# Altium schematic sheet 1_AT32_FOC_CORE.schdoc.schdoc
size 850 x 607 mm; Symbol: Sheet-Symbol_A3; Device: Sheet-Symbol_A3; Company: 嘉立创EDA; Version: V1.0; Page Size: A3; @Project Name: 基于AT32F413 的FOC驱动器; @Page Count: 1; @Update Date: 2024-04-27; @Create Date: 2023-11-18; @Schematic Name: AT32_FOC; @Page No: 1; @Page Name: AT32_FOC_CORE
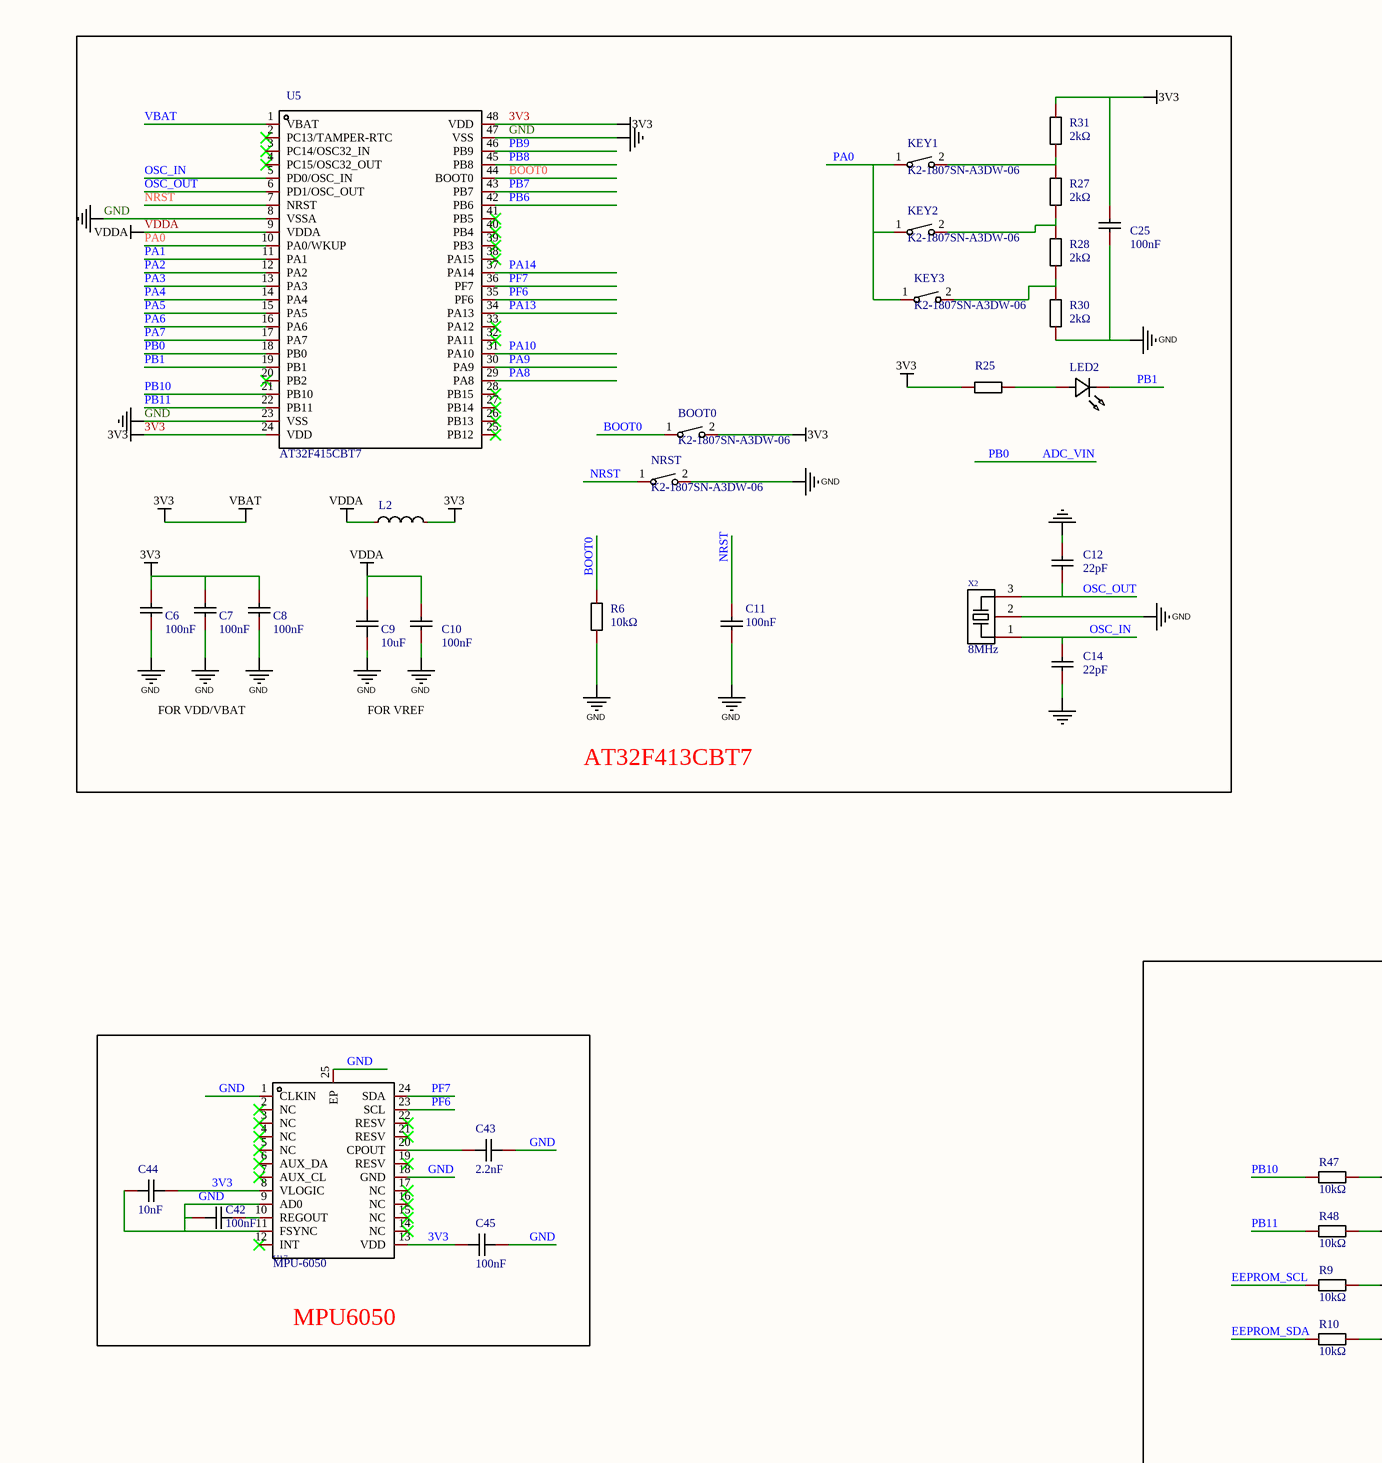
[diagram p0: 1_AT32_FOC_CORE.schdoc.schdoc, top left]
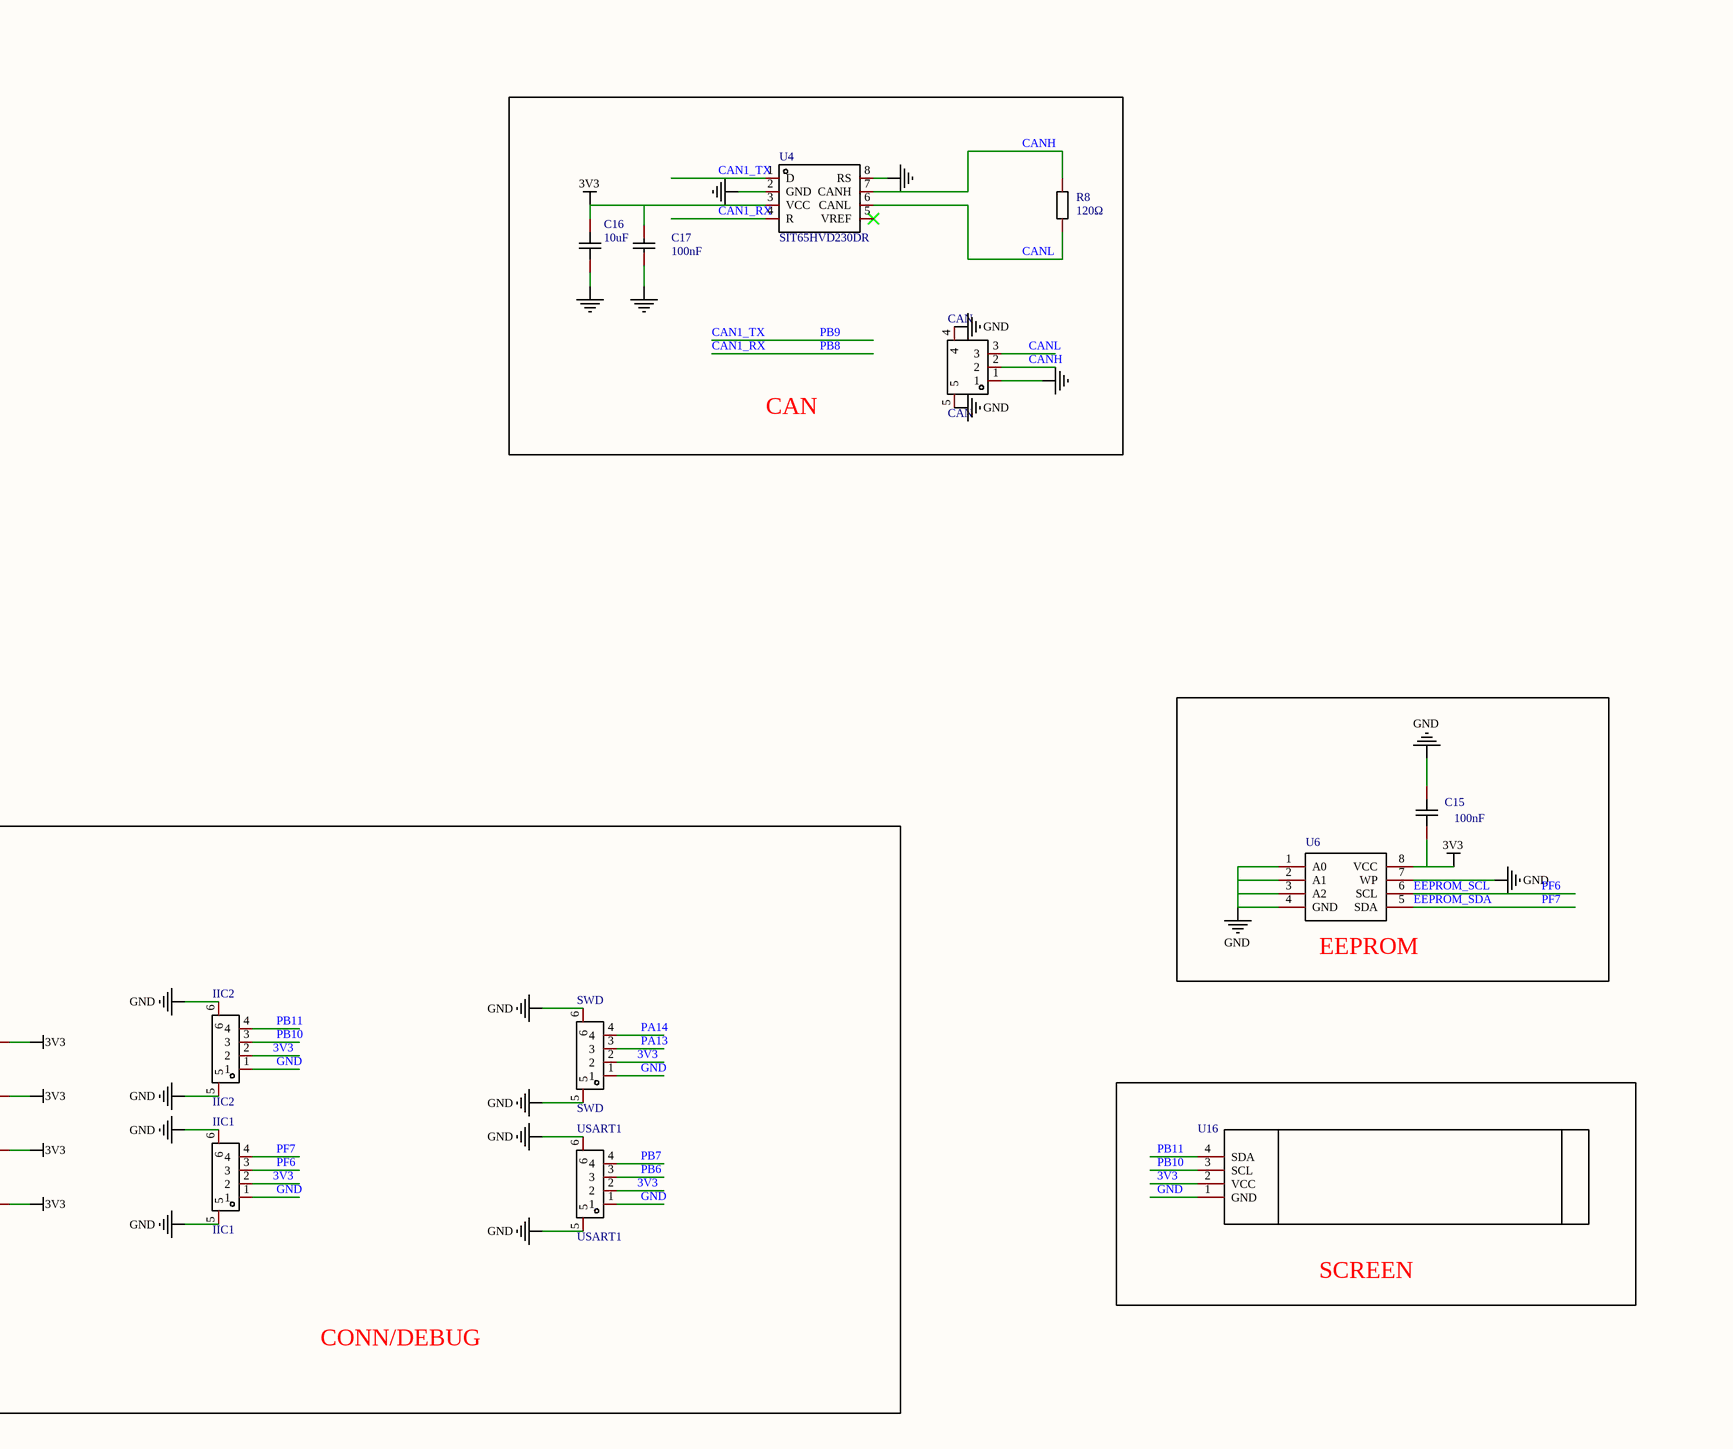
[diagram p1: 1_AT32_FOC_CORE.schdoc.schdoc, top middle]
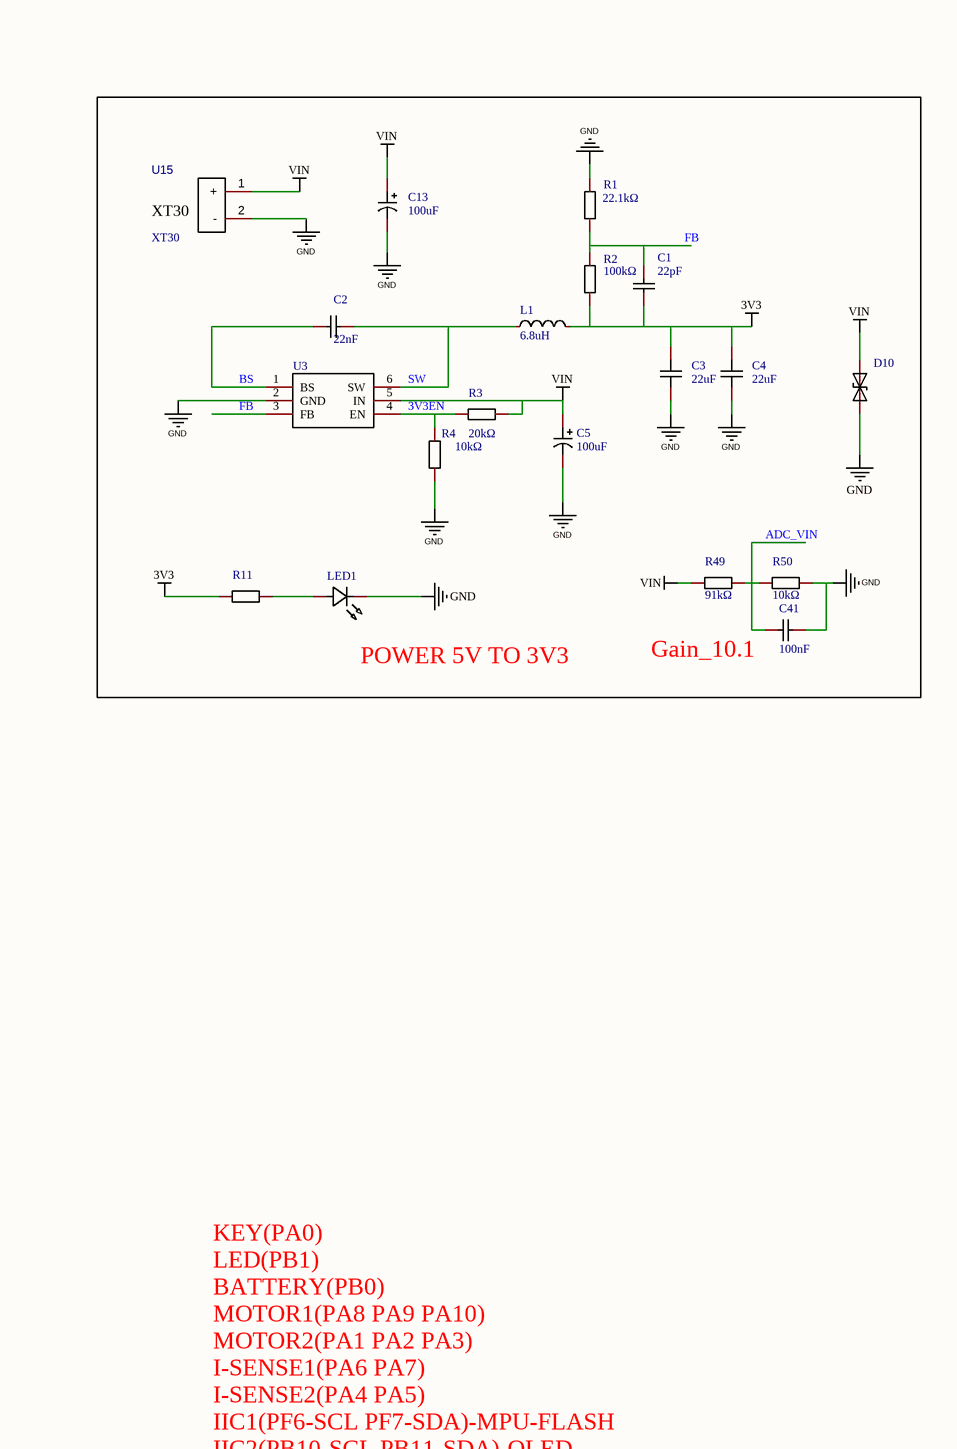
[diagram p2: 1_AT32_FOC_CORE.schdoc.schdoc, top right]
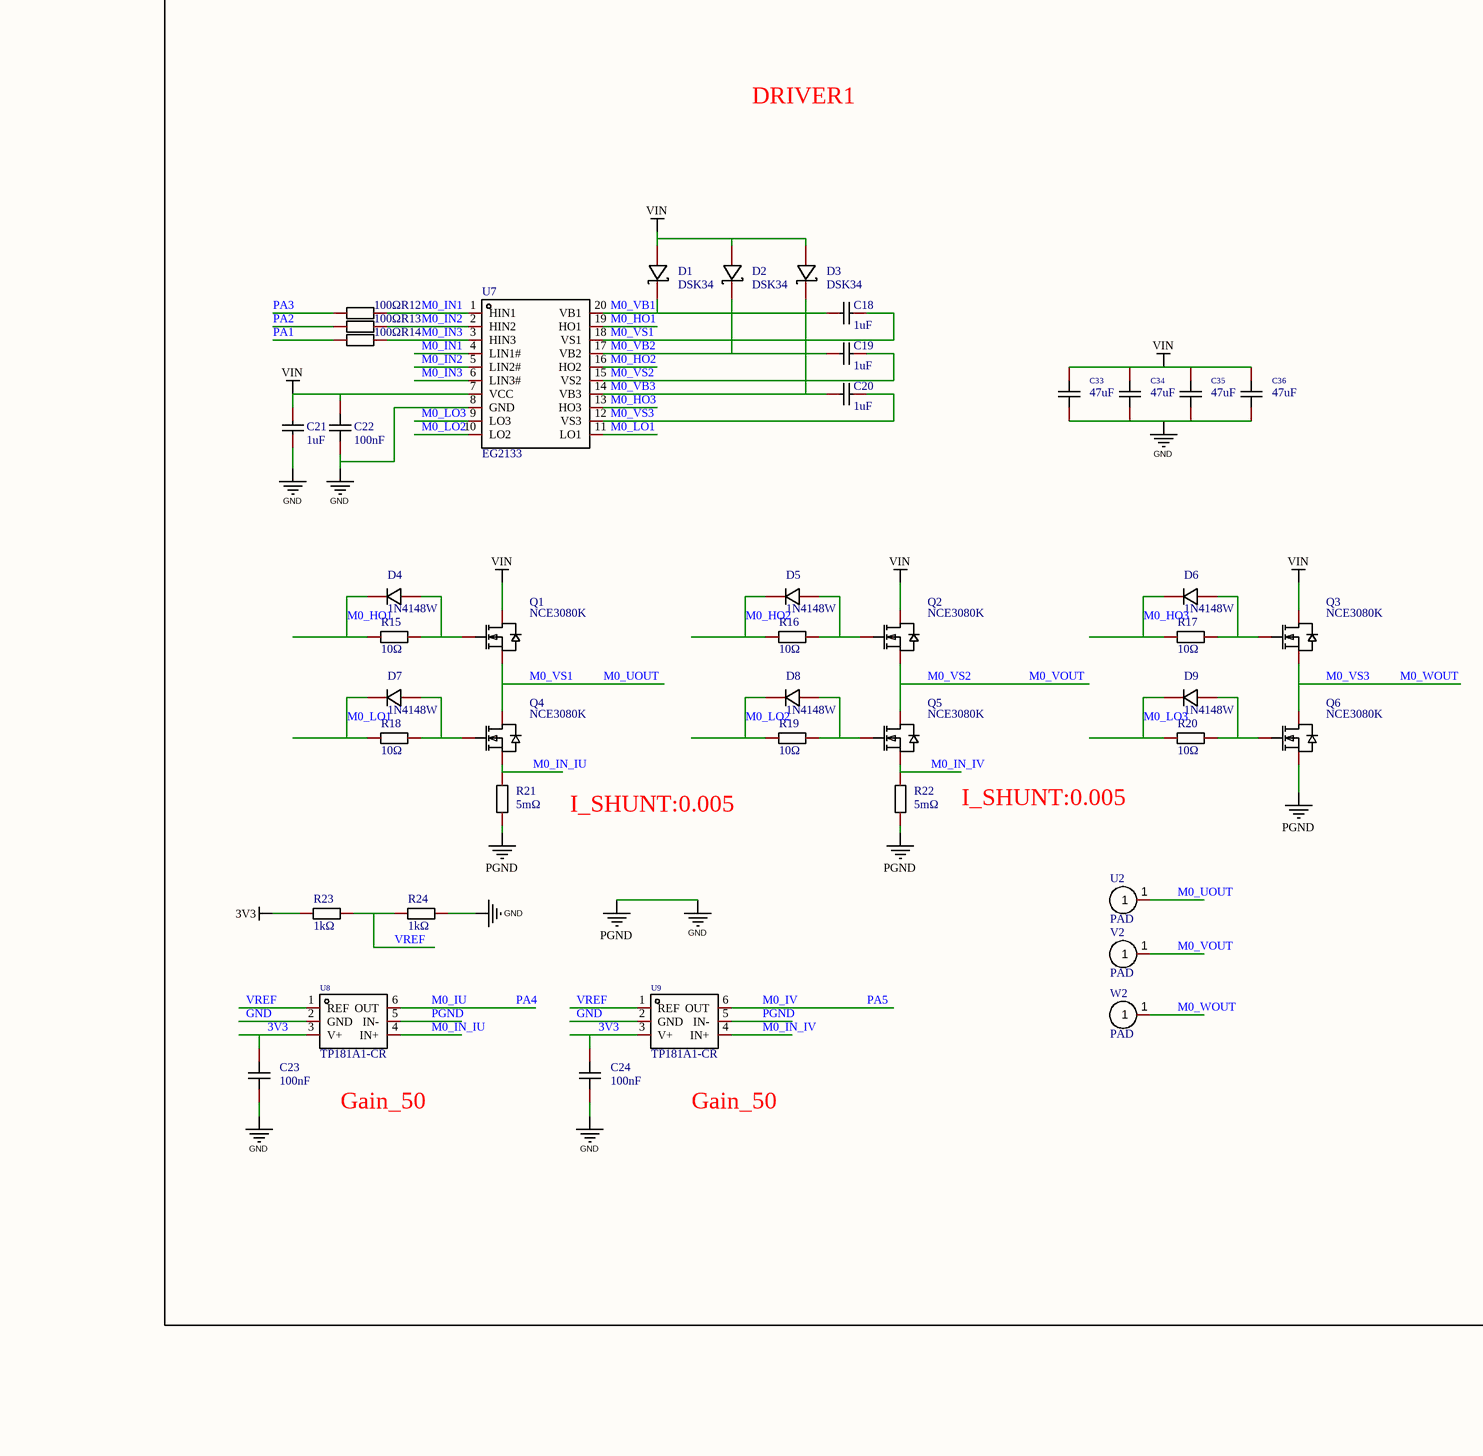
[diagram p3: 1_AT32_FOC_CORE.schdoc.schdoc, bottom left]
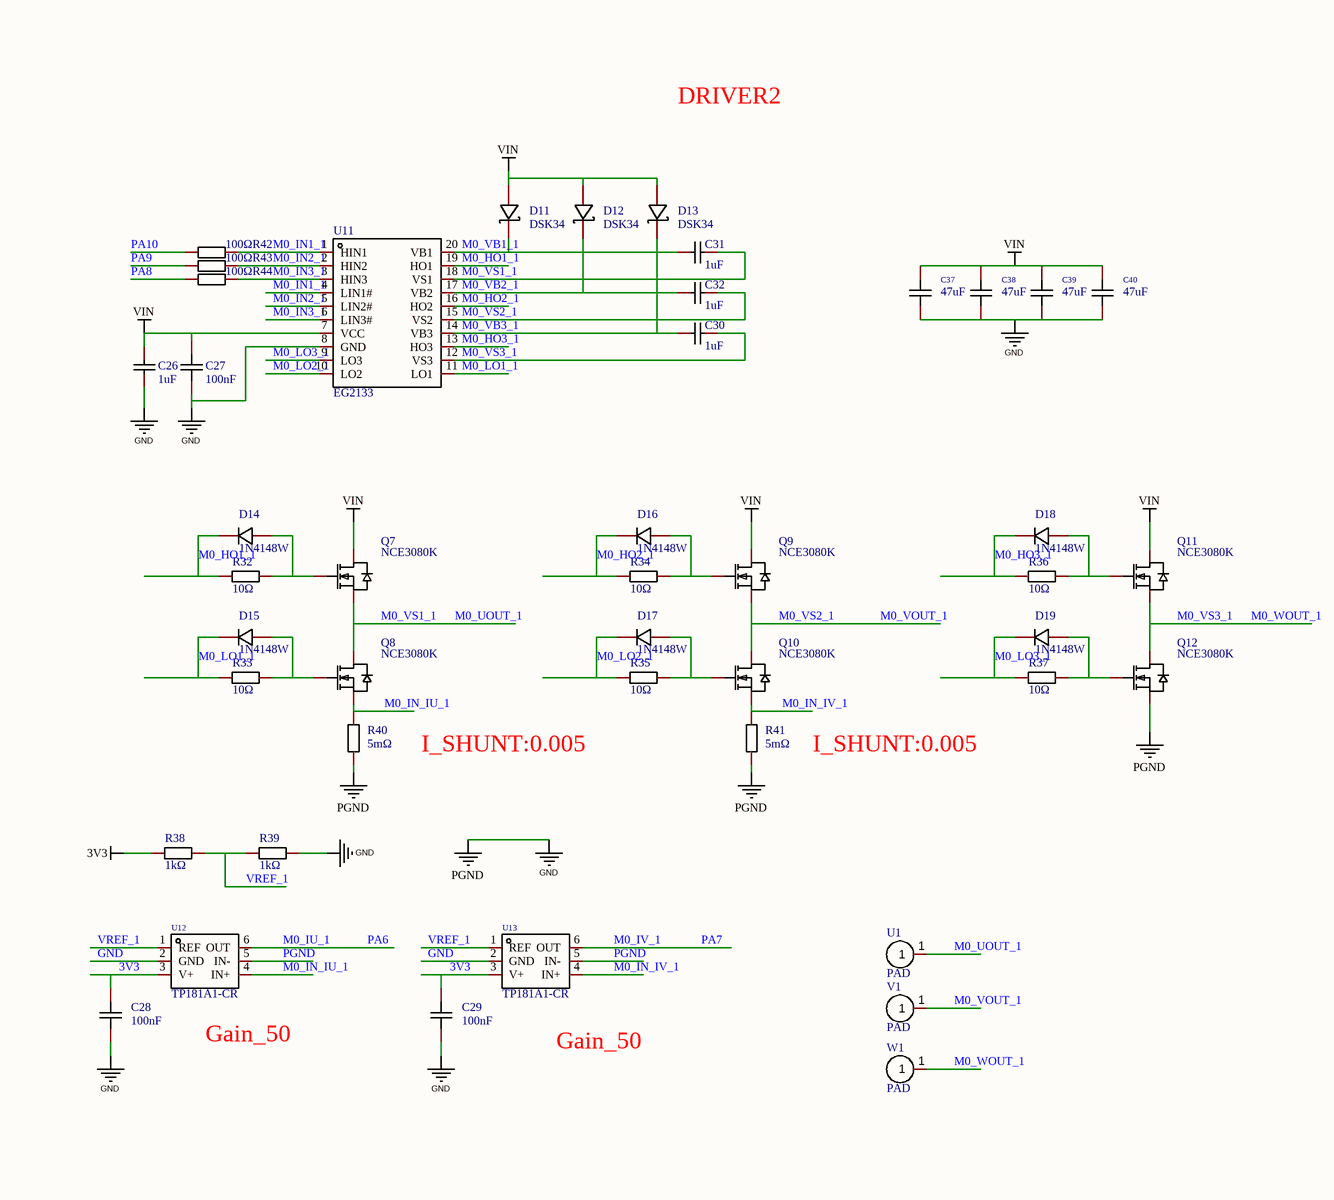
[diagram p4: 1_AT32_FOC_CORE.schdoc.schdoc, bottom middle]

## Parts
BOOT0  K2-1807SN-A3DW-06  [SW-SMD_L4.0-W2.9-LS5.0]
C1  22pF  [C0402]
C2  22nF  [C0402]
C3  22uF  [C1206]
C4  22uF  [C1206]
C5  100uF  [CAP-SMD_BD6.3-L6.6-W6.6-LS7.2-FD]
C6  100nF  [C0402]
C7  100nF  [C0402]
C8  100nF  [C0402]
C9  10uF  [C1206]
C10  100nF  [C0402]
C11  100nF  [C0402]
C12  22pF  [C0402]
C13  100uF  [CAP-SMD_BD6.3-L6.6-W6.6-LS7.2-FD]
C14  22pF  [C0402]
C15  100nF  [C0402]
C16  10uF  [C0402]
C17  100nF  [C0402]
C18  1uF  [C0402]
C19  1uF  [C0402]
C20  1uF  [C0402]
C21  1uF  [C0402]
C22  100nF  [C0402]
C23  100nF  [C0402]
C24  100nF  [C0402]
C25  100nF  [C0402]
C26  1uF  [C0402]
C27  100nF  [C0402]
C28  100nF  [C0402]
C29  100nF  [C0402]
C30  1uF  [C0402]
C31  1uF  [C0402]
C32  1uF  [C0402]
C33  47uF  [C1206]
C34  47uF  [C1206]
C35  47uF  [C1206]
C36  47uF  [C1206]
C37  47uF  [C1206]
C38  47uF  [C1206]
C39  47uF  [C1206]
C40  47uF  [C1206]
C41  100nF  [C0402]
C42  100nF  [C0402]
C43  2.2nF  [C0402]
C44  10nF  [C0402]
C45  100nF  [C0402]
CAN  CAN  [CONN-SMD_AFC10-S03QCA-00]
D1  DSK34  [SOD-123_L2.8-W1.8-LS3.7-RD]
D2  DSK34  [SOD-123_L2.8-W1.8-LS3.7-RD]
D3  DSK34  [SOD-123_L2.8-W1.8-LS3.7-RD]
D4  1N4148W  [SOD-123F_L2.7-W1.6-LS3.8-RD]
D5  1N4148W  [SOD-123F_L2.7-W1.6-LS3.8-RD]
D6  1N4148W  [SOD-123F_L2.7-W1.6-LS3.8-RD]
D7  1N4148W  [SOD-123F_L2.7-W1.6-LS3.8-RD]
D8  1N4148W  [SOD-123F_L2.7-W1.6-LS3.8-RD]
D9  1N4148W  [SOD-123F_L2.7-W1.6-LS3.8-RD]
D10  SMAJ12CA/TR13  [SMA_L4.4-W2.6-LS5.0-BI]  (value not drawn)
D11  DSK34  [SOD-123_L2.8-W1.8-LS3.7-RD]
D12  DSK34  [SOD-123_L2.8-W1.8-LS3.7-RD]
D13  DSK34  [SOD-123_L2.8-W1.8-LS3.7-RD]
D14  1N4148W  [SOD-123F_L2.7-W1.6-LS3.8-RD]
D15  1N4148W  [SOD-123F_L2.7-W1.6-LS3.8-RD]
D16  1N4148W  [SOD-123F_L2.7-W1.6-LS3.8-RD]
D17  1N4148W  [SOD-123F_L2.7-W1.6-LS3.8-RD]
D18  1N4148W  [SOD-123F_L2.7-W1.6-LS3.8-RD]
D19  1N4148W  [SOD-123F_L2.7-W1.6-LS3.8-RD]
IIC1  IIC1  [CONN-SMD_AFC10-S04QCA-00]
IIC2  IIC2  [CONN-SMD_AFC10-S04QCA-00]
KEY1  K2-1807SN-A3DW-06  [SW-SMD_L4.0-W2.9-LS5.0]
KEY2  K2-1807SN-A3DW-06  [SW-SMD_L4.0-W2.9-LS5.0]
KEY3  K2-1807SN-A3DW-06  [SW-SMD_L4.0-W2.9-LS5.0]
L1  value 6.8uH  [IND-SMD_L7.1-W6.6]  (hidden comment: 0630 6.8uH)
L2  CMH160808B3R3MT  [L0603]  (value not drawn)
LED1  XL-1608UBC-04  [LED0603-RD_BLUE]  (value not drawn)
LED2  XL-1608UBC-04  [LED0603-RD_BLUE]  (value not drawn)
NRST  K2-1807SN-A3DW-06  [SW-SMD_L4.0-W2.9-LS5.0]
Q1  NCE3080K  [TO-252-2_L6.6-W6.1-P4.57-LS9.9-TL-CW]
Q2  NCE3080K  [TO-252-2_L6.6-W6.1-P4.57-LS9.9-TL-CW]
Q3  NCE3080K  [TO-252-2_L6.6-W6.1-P4.57-LS9.9-TL-CW]
Q4  NCE3080K  [TO-252-2_L6.6-W6.1-P4.57-LS9.9-TL-CW]
Q5  NCE3080K  [TO-252-2_L6.6-W6.1-P4.57-LS9.9-TL-CW]
Q6  NCE3080K  [TO-252-2_L6.6-W6.1-P4.57-LS9.9-TL-CW]
Q7  NCE3080K  [TO-252-2_L6.6-W6.1-P4.57-LS9.9-TL-CW]
Q8  NCE3080K  [TO-252-2_L6.6-W6.1-P4.57-LS9.9-TL-CW]
Q9  NCE3080K  [TO-252-2_L6.6-W6.1-P4.57-LS9.9-TL-CW]
Q10  NCE3080K  [TO-252-2_L6.6-W6.1-P4.57-LS9.9-TL-CW]
Q11  NCE3080K  [TO-252-2_L6.6-W6.1-P4.57-LS9.9-TL-CW]
Q12  NCE3080K  [TO-252-2_L6.6-W6.1-P4.57-LS9.9-TL-CW]
R1  22.1kΩ  [R0402]
R2  100kΩ  [R0402]
R3  20kΩ  [R0402]
R4  10kΩ  [R0402]
R6  10kΩ  [R0402]
R8  120Ω  [R0402]
R9  10kΩ  [R0402]
R10  10kΩ  [R0402]
R11  5.1kΩ  [R0402]  (value not drawn)
R12  100Ω  [R0402]
R13  100Ω  [R0402]
R14  100Ω  [R0402]
R15  10Ω  [R0805_NEW]
R16  10Ω  [R0805_NEW]
R17  10Ω  [R0805_NEW]
R18  10Ω  [R0805_NEW]
R19  10Ω  [R0805_NEW]
R20  10Ω  [R0805_NEW]
R21  5mΩ  [RES-SMD_L6.4-W3.2-1]
R22  5mΩ  [RES-SMD_L6.4-W3.2-1]
R23  1kΩ  [R0402]
R24  1kΩ  [R0402]
R25  5.1kΩ  [R0402]  (value not drawn)
R27  2kΩ  [R0402]
R28  2kΩ  [R0402]
R30  2kΩ  [R0402]
R31  2kΩ  [R0402]
R32  10Ω  [R0805_NEW]
R33  10Ω  [R0805_NEW]
R34  10Ω  [R0805_NEW]
R35  10Ω  [R0805_NEW]
R36  10Ω  [R0805_NEW]
R37  10Ω  [R0805_NEW]
R38  1kΩ  [R0402]
R39  1kΩ  [R0402]
R40  5mΩ  [RES-SMD_L6.4-W3.2-1]
R41  5mΩ  [RES-SMD_L6.4-W3.2-1]
R42  100Ω  [R0402]
R43  100Ω  [R0402]
R44  100Ω  [R0402]
R47  10kΩ  [R0402]
R48  10kΩ  [R0402]
R49  91kΩ  [R0402]
R50  10kΩ  [R0402]
SWD  SWD  [CONN-SMD_AFC10-S04QCA-00]
U1  PAD  [PAD-1.5]
U2  PAD  [PAD-1.5]
U3  MT2492  [SOT-23-6_L2.9-W1.6-P0.95-LS2.8-BL]  (value not drawn)
U4  SIT65HVD230DR  [SOP-8_L4.9-W3.9-P1.27-LS6.0-BL]
U5  AT32F415CBT7  [LQFP-48_L7.0-W7.0-P0.50-LS9.0-BL]
U6  AT24C02C-SSHM-T  [SOIC-8_L5.0-W4.0-P1.27-LS6.0-BL]  (value not drawn)
U7  EG2133  [TSSOP-20_L6.5-W4.4-P0.65-LS6.4-BL]
U8  TP181A1-CR  [SC70-6_L2.1-W1.3-P0.65-LS2.3-BL]
U9  TP181A1-CR  [SC70-6_L2.1-W1.3-P0.65-LS2.3-BL]
U11  EG2133  [TSSOP-20_L6.5-W4.4-P0.65-LS6.4-BL]
U12  TP181A1-CR  [SC70-6_L2.1-W1.3-P0.65-LS2.3-BL]
U13  TP181A1-CR  [SC70-6_L2.1-W1.3-P0.65-LS2.3-BL]
U15  XT30  [XT-30]
U16  0.91OLED-4P-IIC模块  [OLED-0.91-2.54*4P-IIC]  (value not drawn)
U17  MPU-6050  [QFN-24_L4.0-W4.0-P0.50-BL-EP2.7]
USART1  USART1  [CONN-SMD_AFC10-S04QCA-00]
V1  PAD  [PAD-1.5]
V2  PAD  [PAD-1.5]
W1  PAD  [PAD-1.5]
W2  PAD  [PAD-1.5]
X2  8MHz  [OSC-SMD_3P-L3.2-W1.3-P1.2-L]

## Blocks framed on the sheet
AT32F413CBT7: BOOT0 C6-C12 C14 C25 KEY1-KEY3 L2 LED2 NRST R6 R25 R27 R28 R30 R31 U5 X2
CAN: C16 C17 CAN R8 U4
EEPROM: C15 U6
CONN/DEBUG: IIC1 IIC2 R9 R10 R47 R48 SWD USART1
MPU6050: C42-C45 U17
SCREEN: U16

## Nets
3V3: BOOT0.2 C1.1 C3.2 C4.2 C6.2 C7.2 C8.2 C15.1 C16.2 C17.2 C23.1 C24.1 C25.2 C28.1 C29.1 C44.1 C45.2 IIC1.2 IIC2.2 L1.2 L2.2 R2.1 R9.2 R10.2 R11.1 R23.1 R25.1 R31.2 R38.1 R47.2 R48.2 SWD.2 U4.3(VCC) U5.1(VBAT) U5.24(VDD) U5.48(VDD) U6.8(VCC) U8.3(V+) U9.3(V+) U12.3(V+) U13.3(V+) U16.2(VCC) U17.8(VLOGIC) U17.13(VDD) USART1.2  [also labelled VBAT]
GND: C3.1 C4.1 C5.2 C6.1 C7.1 C8.1 C9.1 C10.1 C11.1 C12.2 C13.2 C14.1 C15.2 C16.1 C17.1 C21.1 C22.1 C23.2 C24.2 C25.1 C26.1 C27.1 C28.2 C29.2 C33.2 C34.2 C35.2 C36.2 C37.2 C38.2 C39.2 C40.2 C41.1 C42.2 C43.1 C44.2 C45.1 CAN.1 CAN.4 CAN.5 D10.1 IIC1.1 IIC1.5 IIC1.6 IIC2.1 IIC2.5 IIC2.6 LED1.1(K) NRST.2 Q6.3(S) Q12.3(S) R1.2 R4.1 R6.1 R21.1 R22.1 R24.2 R30.1 R39.2 R40.1 R41.1 R50.2 SWD.1 SWD.5 SWD.6 U3.2(GND) U4.2(GND) U4.8(RS) U5.8(VSSA) U5.23(VSS) U5.47(VSS) U6.1(A0) U6.2(A1) U6.3(A2) U6.4(GND) U6.7(WP) U7.8(GND) U8.2(GND) U8.5(IN-) U9.2(GND) U9.5(IN-) U11.8(GND) U12.2(GND) U12.5(IN-) U13.2(GND) U13.5(IN-) U15.2(-) U16.1(GND) U17.1(CLKIN) U17.9(AD0) U17.11(FSYNC) U17.18(GND) U17.25(EP) USART1.1 USART1.5 USART1.6 X2.2  [also labelled PGND]
VDDA: C9.2 C10.2 L2.1 U5.9(VDDA)
VIN: C5.1 C13.1 C21.2 C22.2 C26.2 C27.2 C33.1 C34.1 C35.1 C36.1 C37.1 C38.1 C39.1 C40.1 D1.2(A) D2.2(A) D3.2(A) D10.2 D11.2(A) D12.2(A) D13.2(A) Q1.2(D) Q2.2(D) Q3.2(D) Q7.2(D) Q9.2(D) Q11.2(D) R3.2 R49.1 U3.5(IN) U7.7(VCC) U11.7(VCC) U15.1(+)
3V3EN: R3.1 R4.2 U3.4(EN)
ADC_VIN: C41.2 R49.2 R50.1 U5.18(PB0)  [also labelled PB0]
BOOT0: BOOT0.1 R6.2 U5.44(BOOT0)
BS: C2.1 U3.1(BS)
CAN1_RX: U4.4(R) U5.45(PB8)  [also labelled PB8]
CAN1_TX: U4.1(D) U5.46(PB9)  [also labelled PB9]
CANH: CAN.2 R8.1 U4.7(CANH)
CANL: CAN.3 R8.2 U4.6(CANL)
EEPROM_SCL: IIC1.3 R9.1 U5.35(PF6) U6.6(SCL) U17.23(SCL)  [also labelled PF6]
EEPROM_SDA: IIC1.4 R10.1 U5.36(PF7) U6.5(SDA) U17.24(SDA)  [also labelled PF7]
FB: C1.2 R1.1 R2.2 U3.3(FB)
M0_HO1: D4.1(K) R15.1 U7.19(HO1)
M0_HO1_1: D14.1(K) R32.1 U11.19(HO1)
M0_HO2: D5.1(K) R16.1 U7.16(HO2)
M0_HO2_1: D16.1(K) R34.1 U11.16(HO2)
M0_HO3: D6.1(K) R17.1 U7.13(HO3)
M0_HO3_1: D18.1(K) R36.1 U11.13(HO3)
M0_IN1: R12.2 U7.1(HIN1) U7.4(LIN1#)
M0_IN1_1: R42.2 U11.1(HIN1) U11.4(LIN1#)
M0_IN2: R13.2 U7.2(HIN2) U7.5(LIN2#)
M0_IN2_1: R43.2 U11.2(HIN2) U11.5(LIN2#)
M0_IN3: R14.2 U7.3(HIN3) U7.6(LIN3#)
M0_IN3_1: R44.2 U11.3(HIN3) U11.6(LIN3#)
M0_IN_IU: Q4.3(S) R21.2 U8.4(IN+)
M0_IN_IU_1: Q8.3(S) R40.2 U12.4(IN+)
M0_IN_IV: Q5.3(S) R22.2 U9.4(IN+)
M0_IN_IV_1: Q10.3(S) R41.2 U13.4(IN+)
M0_IU: U5.14(PA4) U8.6(OUT)  [also labelled PA4]
M0_IU_1: U5.16(PA6) U12.6(OUT)  [also labelled PA6]
M0_IV: U5.15(PA5) U9.6(OUT)  [also labelled PA5]
M0_IV_1: U5.17(PA7) U13.6(OUT)  [also labelled PA7]
M0_LO1: D7.1(K) R18.1 U7.11(LO1)
M0_LO1_1: D15.1(K) R33.1 U11.11(LO1)
M0_LO2: D8.1(K) R19.1 U7.10(LO2)
M0_LO2_1: D17.1(K) R35.1 U11.10(LO2)
M0_LO3: D9.1(K) R20.1 U7.9(LO3)
M0_LO3_1: D19.1(K) R37.1 U11.9(LO3)
M0_UOUT: C18.1 Q1.3(S) Q4.2(D) U2.1 U7.18(VS1)  [also labelled M0_VS1]
M0_UOUT_1: C31.1 Q7.3(S) Q8.2(D) U1.1 U11.18(VS1)  [also labelled M0_VS1_1]
M0_VB1: C18.2 D1.1(K) U7.20(VB1)
M0_VB1_1: C31.2 D11.1(K) U11.20(VB1)
M0_VB2: C19.2 D2.1(K) U7.17(VB2)
M0_VB2_1: C32.2 D12.1(K) U11.17(VB2)
M0_VB3: C20.2 D3.1(K) U7.14(VB3)
M0_VB3_1: C30.2 D13.1(K) U11.14(VB3)
M0_VOUT: C19.1 Q2.3(S) Q5.2(D) U7.15(VS2) V2.1  [also labelled M0_VS2]
M0_VOUT_1: C32.1 Q9.3(S) Q10.2(D) U11.15(VS2) V1.1  [also labelled M0_VS2_1]
M0_VS3: C20.1 Q3.3(S) Q6.2(D) U7.12(VS3) W2.1  [also labelled M0_WOUT]
M0_VS3_1: C30.1 Q11.3(S) Q12.2(D) U11.12(VS3) W1.1  [also labelled M0_WOUT_1]
NRST: C11.2 NRST.1 U5.7(NRST)
OSC_IN: C14.2 U5.5(PD0/OSC_IN) X2.1
OSC_OUT: C12.1 U5.6(PD1/OSC_OUT) X2.3
PA0: KEY1.1 KEY2.1 KEY3.1 U5.10(PA0/WKUP)
PA1: R14.1 U5.11(PA1)
PA2: R13.1 U5.12(PA2)
PA3: R12.1 U5.13(PA3)
PA8: R44.1 U5.29(PA8)
PA9: R43.1 U5.30(PA9)
PA10: R42.1 U5.31(PA10)
PA13: SWD.3 U5.34(PA13)
PA14: SWD.4 U5.37(PA14)
PB1: LED2.1(K) U5.19(PB1)
PB6: U5.42(PB6) USART1.3
PB7: U5.43(PB7) USART1.4
PB10: IIC2.3 R47.1 U5.21(PB10) U16.3(SCL)
PB11: IIC2.4 R48.1 U5.22(PB11) U16.4(SDA)
SW: C2.2 L1.1 U3.6(SW)
VREF: R23.2 R24.1 U8.1(REF) U9.1(REF)
VREF_1: R38.2 R39.1 U12.1(REF) U13.1(REF)
NetC42_1: C42.1 U17.10(REGOUT)
NetC43_2: C43.2 U17.20(CPOUT)
NetD4_2: D4.2(A) Q1.1(G) R15.2
NetD5_2: D5.2(A) Q2.1(G) R16.2
NetD6_2: D6.2(A) Q3.1(G) R17.2
NetD7_2: D7.2(A) Q4.1(G) R18.2
NetD8_2: D8.2(A) Q5.1(G) R19.2
NetD9_2: D9.2(A) Q6.1(G) R20.2
NetD14_2: D14.2(A) Q7.1(G) R32.2
NetD15_2: D15.2(A) Q8.1(G) R33.2
NetD16_2: D16.2(A) Q9.1(G) R34.2
NetD17_2: D17.2(A) Q10.1(G) R35.2
NetD18_2: D18.2(A) Q11.1(G) R36.2
NetD19_2: D19.2(A) Q12.1(G) R37.2
NetKEY1_2: KEY1.2 R27.2 R31.1
NetKEY2_2: KEY2.2 R27.1 R28.2
NetKEY3_2: KEY3.2 R28.1 R30.2
NetLED1_2: LED1.2(A) R11.2
NetLED2_2: LED2.2(A) R25.2

Not connected (* = marked no-connect by the designer): U4 5(VREF)*; U5 2(PC13/TAMPER-RTC)* 3(PC14/OSC32_IN)* 4(PC15/OSC32_OUT)* 20(PB2)* 25(PB12)* 26(PB13)* 27(PB14)* 28(PB15)* 32(PA11)* 33(PA12)* 38(PA15)* 39(PB3)* 40(PB4)* 41(PB5)*; U17 2(NC)* 3(NC)* 4(NC)* 5(NC)* 6(AUX_DA)* 7(AUX_CL)* 12(INT)* 14(NC)* 15(NC)* 16(NC)* 17(NC)* 19(RESV)* 21(RESV)* 22(RESV)*

## Notes on the sheet
- (near C41) Gain_10.1
- FOR VDD/VBAT
- FOR VREF
- (near LED1) POWER 5V TO 3V3
- KEY(PA0)
  LED(PB1)
  BATTERY(PB0)
  MOTOR1(PA8 PA9 PA10)
  MOTOR2(PA1 PA2 PA3)
  I-SENSE1(PA6 PA7)
  I-SENSE2(PA4 PA5)
  IIC1(PF6-SCL PF7-SDA)-MPU-FLASH
  IIC2(PB10-SCL PB11-SDA)-OLED
  SWD(PA13-CLK PA14-DIO)
  USART1(PB6-TX PB7-RX)
  CAN(PB8-RX PB9-TX)
- DRIVER1
- DRIVER2
- I_SHUNT:0.005
- (near U12) Gain_50
- Gain_50
- 1
- 2
- 3
- 4
- 5
- 6
- A
- B
- C
- D
- 原理图
- AT32_FOC
- 创建日期
- 更新日期
- 2024-04-27
- 2023-11-18
- 审阅
- 绘制
- 图页
- AT32_FOC_CORE
- 物料编码
- 基于AT32F413 的FOC驱动器
- 版本
- 尺寸
- 页
- 共
- V1.0
- A3
- 嘉立创EDA

## Library data of the parts
BOOT0 KEY1-KEY3 NRST = K2-1807SN-A3DW-06: Manufacturer: 韩国韩荣; Add into BOM: yes; Contact Current: 50mA; Voltage Rating (DC): 12V; Insulation Resistance: 100MΩ; Operating Force: 180gf@±30gf; Mechanical Life: 100000; Switch Length: 4mm; Switch Width: 2.9mm; Switch Height: 2mm; Description: 触点电流:50mA;额定电压(DC):12V;绝缘电阻:100MΩ;安装方式:立贴;作用力:180gf@±30gf;机械寿命:100000;工作温度:-25℃~+85℃;开关长度:4mm;开关宽度:2.9mm;开关高度:2mm;; Name: K2-1807SN-A3DW-06; Symbol: K2-1807SN-A3DW-06; Device: K2-1807SN-A3DW-06; LCSC Part Name: 3×4×2 160G 2P 无柱 双弹片 防水膜; Supplier Part: C707338; Manufacturer Part: K2-1807SN-A3DW-06; Supplier Footprint: SMD; JLCPCB Part Class: 扩展库; Datasheet: https://atta.szlcsc.com/upload/public/pdf/source/20210810/47B2303F2A54EA82C8741CE08BEBC5F9.pdf; Supplier: LCSC; Convert to PCB: yes; Mounting Style: 立贴; Operating Temperature: -25℃~+85℃
C1 C12 C14 = CL10C220JB8NNNC: Manufacturer: SAMSUNG(三星); Add into BOM: yes; Tolerance: ±5%; Voltage Rated: 50V; Temperature Coefficient: C0G; Description: 容值:22pF;精度:±5%;额定电压:50V;材质(温度系数):C0G;; Name: 22pF; Symbol: CL10C220JB8NNNC; Device: CL10C220JB8NNNC; LCSC Part Name: 22pF ±5% 50V; Supplier Part: C1653; Manufacturer Part: CL10C220JB8NNNC; Supplier Footprint: 0603; JLCPCB Part Class: Basic Part; Datasheet: https://atta.szlcsc.com/upload/public/pdf/source/20160103/1457707687317.pdf; Supplier: LCSC; Convert to PCB: yes; Value: 22pF
C2 = CL10B223KB8NNNC: Manufacturer: SAMSUNG(三星); Add into BOM: yes; Tolerance: ±10%; Voltage Rated: 50V; Temperature Coefficient: X7R; Description: 容值:22nF;精度:±10%;额定电压:50V;材质(温度系数):X7R;; Name: 22nF; Symbol: CL10B223KB8NNNC; Device: CL10B223KB8NNNC; LCSC Part Name: 22nF ±10% 50V; Supplier Part: C21122; Manufacturer Part: CL10B223KB8NNNC; Supplier Footprint: 0603; JLCPCB Part Class: Basic Part; Datasheet: https://atta.szlcsc.com/upload/public/pdf/source/20160103/1457707705232.pdf; Supplier: LCSC; Convert to PCB: yes; Value: 22nF
C3 C4 = CL21A226MAQNNNE_C45783: Manufacturer: SAMSUNG(三星); Add into BOM: yes; Tolerance: ±20%; Voltage Rated: 25V; Temperature Coefficient: X5R; Description: 容值:22uF;精度:±20%;额定电压:25V;材质(温度系数):X5R;; Name: 22uF; Symbol: CL21A226MAQNNNE; Device: CL21A226MAQNNNE_C45783; LCSC Part Name: 22uF ±20% 25V; Supplier Part: C45783; Manufacturer Part: CL21A226MAQNNNE; Supplier Footprint: 0805; JLCPCB Part Class: 基础库; Datasheet: https://atta.szlcsc.com/upload/public/pdf/source/20160103/1457707727161.pdf; Supplier: LCSC; Convert to PCB: yes; Value: 22uF
C5 C13 = PM101M025E077PTR: Manufacturer: CapXon(丰宾); Add into BOM: yes; Tolerance: ±20%; Rated Voltage: 25V; Description: 容值:100uF;精度:±20%;额定电压:25V;; Name: 100uF; Symbol: PM101M025E077PTR; Device: PM101M025E077PTR; LCSC Part Name: 100uF ±20% 25V; Supplier Part: C2858382; Manufacturer Part: PM101M025E077PTR; Supplier Footprint: SMD,6.3x7.7mm; JLCPCB Part Class: 扩展库; Datasheet: https://atta.szlcsc.com/upload/public/pdf/source/20210804/C2858382_57ECED37ED638FF3D71FBD68EF7F0C39.pdf; Supplier: LCSC; Convert to PCB: yes; Value: 100uF
C6-C8 C10 C11 C17 C25 C41 = 0603B104K500NT: Manufacturer: FH(风华); Add into BOM: yes; Tolerance: ±10%; Voltage Rated: 50V; Temperature Coefficient: X7R; Description: 容值:100nF;精度:±10%;额定电压:50V;材质(温度系数):X7R;; Name: 100nF; Symbol: 0603B104K500NT; Device: 0603B104K500NT; LCSC Part Name: 100nF ±10% 50V; Supplier Part: C30926; Manufacturer Part: 0603B104K500NT; Supplier Footprint: 0603; JLCPCB Part Class: Extended Part; Datasheet: https://atta.szlcsc.com/upload/public/pdf/source/20170923/C30926_1506149436298988724.pdf; Supplier: LCSC; Convert to PCB: yes; Value: 100nF
C9 C16 = CL10A106KP8NNNC: Manufacturer: SAMSUNG(三星); Add into BOM: yes; Tolerance: ±10%; Voltage Rated: 10V; Temperature Coefficient: X5R; Description: 容值:10uF;精度:±10%;额定电压:10V;材质(温度系数):X5R;; Name: 10uF; Symbol: CL10A106KP8NNNC; Device: CL10A106KP8NNNC; LCSC Part Name: 10uF ±10% 10V; Supplier Part: C19702; Manufacturer Part: CL10A106KP8NNNC; Supplier Footprint: 0603; JLCPCB Part Class: Basic Part; Datasheet: https://atta.szlcsc.com/upload/public/pdf/source/20160103/1457707703378.pdf; Supplier: LCSC; Convert to PCB: yes; Value: 10uF
C15 C42-C45 = CC0603KRX7R9BB104: 容值:100nF;精度:±10%;额定电压:50V;材质(温度系数):X7R;; Manufacturer: YAGEO(国巨); Add into BOM: yes; Tolerance: ±10%; Voltage Rated: 50V; Temperature Coefficient: X7R; Symbol: CC0603KRX7R9BB104; Device: CC0603KRX7R9BB104; LCSC Part Name: 100nF ±10% 50V; Supplier Part: C14663; Manufacturer Part: CC0603KRX7R9BB104; Supplier Footprint: 0603; JLCPCB Part Class: Basic Part; Datasheet: https://atta.szlcsc.com/upload/public/pdf/source/20180910/C282072_33301C7F631E79921B82A8DAC6BCC5B3.pdf; Supplier: LCSC; Convert to PCB: yes
  C15 C42 C45: Name: 100nF; Value: 100nF
  C43: Name: 2.2nF; Value: 2.2nF
  C44: Name: 10nF; Value: 10nF
C18-C21 C26 C30-C32 = CL10A105KB8NNNC: Manufacturer: SAMSUNG(三星); Add into BOM: yes; Tolerance: ±10%; Voltage Rated: 50V; Temperature Coefficient: X5R; Description: 容值:1uF;精度:±10%;额定电压:50V;材质(温度系数):X5R;; Name: 1uF; Symbol: CL10A105KB8NNNC; Device: CL10A105KB8NNNC; LCSC Part Name: 1uF ±10% 50V; Supplier Part: C15849; Manufacturer Part: CL10A105KB8NNNC; Supplier Footprint: 0603; JLCPCB Part Class: Basic Part; Datasheet: https://atta.szlcsc.com/upload/public/pdf/source/20160103/1457707679084.pdf; Supplier: LCSC; Convert to PCB: yes; Value: 1uF
C22-C24 C27-C29 = CC0603KRX7R9BB104: Manufacturer: YAGEO(国巨); Add into BOM: yes; Tolerance: ±10%; Voltage Rated: 50V; Temperature Coefficient: X7R; Description: 容值:100nF;精度:±10%;额定电压:50V;材质(温度系数):X7R;; Name: 100nF; Symbol: CC0603KRX7R9BB104; Device: CC0603KRX7R9BB104; LCSC Part Name: 100nF ±10% 50V; Supplier Part: C14663; Manufacturer Part: CC0603KRX7R9BB104; Supplier Footprint: 0603; JLCPCB Part Class: 基础库; Datasheet: https://atta.szlcsc.com/upload/public/pdf/source/20180910/C282072_33301C7F631E79921B82A8DAC6BCC5B3.pdf; Supplier: LCSC; Convert to PCB: yes; Value: 100nF
C33-C40 = GRM31CR61E476ME44L: Manufacturer: muRata(村田); Add into BOM: yes; Tolerance: ±20%; Voltage Rated: 25V; Temperature Coefficient: X5R; Description: 容值:47uF;精度:±20%;额定电压:25V;材质(温度系数):X5R;; Name: 47uF; Symbol: GRM31CR61E476ME44L; Device: GRM31CR61E476ME44L; Supplier: LCSC; Supplier Part: C403725; Manufacturer Part: GRM31CR61E476ME44L; Value: 47uF; JLCPCB Part Class: 扩展库; LCSC Part Name: 47uF ±20% 25V; Supplier Footprint: 1206; Datasheet: https://atta.szlcsc.com/upload/public/pdf/source/20191025/C403725_B8A8CD2FFA1F57E6FDF268BD106459D5.pdf; Convert to PCB: yes
CAN = AFC10-S03QCA-00: Manufacturer: JS(钜硕电子); Add into BOM: yes; Reference Series: SH; Pitch: 1mm; Pins Structure: 1x3P; Number of PINs Per Row: 3; Gender: 公型插针; Current Rating (Max): 500mA; Description: 参考系列:SH;间距:1mm;插针结构:1x3P;排数:1;每排PIN数:3;行距:-;公母:公型插针;安装方式:卧贴;额定电流:500mA;工作温度范围:-25℃~+85℃;; Name: CAN; Symbol: AFC10-S03QCA-00; Device: AFC10-S03QCA-00; LCSC Part Name: SH 1.0mm 卧式贴片 3P; Supplier Part: C2764182; Manufacturer Part: CAN; Supplier Footprint: SMD,P=1mm; JLCPCB Part Class: Extended Part; Datasheet: https://atta.szlcsc.com/upload/public/pdf/source/20210330/C2764181_391AED87194E28CE940989A69A8EDCC4.pdf; Supplier: LCSC; Convert to PCB: yes; Number of Rows: 1; Row Spacing: -; Mounting Style: 卧贴; Operating Temperature Range: -25℃~+85℃
D1-D3 D11-D13 = DSK34_C41029: Manufacturer: MDD; Add into BOM: yes; Reverse Voltage (Vr): 40V; Average Rectified Current (Io): 3A; Forward Voltage (Vf@If): 550mV@3A; Description: 直流反向耐压(Vr):40V;平均整流电流(Io):3A;正向压降(Vf):550mV@3A;; Name: DSK34; Symbol: DSK34; Device: DSK34_C41029; LCSC Part Name: 40V 3A 550mV@3A; Supplier Part: C41029; Manufacturer Part: DSK34; Supplier Footprint: SOD-123FL; JLCPCB Part Class: Extended Part; Datasheet: https://atta.szlcsc.com/upload/public/pdf/source/20190305/C41029_7EEC8BE9111EDCB4600664A05F84C156.pdf; Supplier: LCSC; Convert to PCB: yes
D4-D9 D14-D19 = 1N4148W_C81598: Manufacturer: ST(先科); Add into BOM: yes; Diode Configuration: 独立式; Power Dissipation: 400mW; Reverse Voltage (Vr): 75V; Average Rectified Current (Io): 150mA; Forward Voltage (Vf@If): 1V@50mA; Reverse Leakage Current: 1uA@75V; Reverse Recovery Time (trr): 4ns; Description: 二极管配置:独立式;功率:400mW;直流反向耐压(Vr):75V;平均整流电流(Io):150mA;正向压降(Vf):1V@50mA;反向恢复时间(trr):4ns;; Name: 1N4148W; Symbol: 1N4148W_C81598; Device: 1N4148W_C81598; LCSC Part Name: 75V 150mA 4ns; Supplier Part: C81598; Manufacturer Part: 1N4148W; Supplier Footprint: SOD-123; JLCPCB Part Class: 基础库; Datasheet: https://atta.szlcsc.com/upload/public/pdf/source/20161024/1477288446905.pdf; Supplier: LCSC; Convert to PCB: yes; Operating Temperature: +150℃@(Tj)
D10 = SMAJ12CA/TR13: 极性:双向;反向截止电压(Vrwm):12V;击穿电压(最小值):13.3V;击穿电压(最大值):14.7V;反向漏电流(Ir):1uA;峰值脉冲电流(Ipp)@10/1000s:20.1A;最大钳位电压:19.9V;; Manufacturer: Brightking(君耀电子); Symbol: SMAJ12CA-C78399; Add into BOM: yes; Polarity: 双向; Reverse Stand-Off Voltage (Vrwm): 12V; Breakdown Voltage (Min): 13.3V; Breakdown Voltage (Max): 14.7V; Reverse Leakage Current (Ir): 1uA; Peak Pulse Current (Ipp)@10/1000μs: 20.1A; Maximum Clamping Voltage: 19.9V; Name: SMAJ12CA/TR13; Device: SMAJ12CA/TR13; LCSC Part Name: 双向 Vrwm:12V; Supplier Part: C78399; Manufacturer Part: SMAJ12CA/TR13; Supplier Footprint: SMA(DO-214AC); JLCPCB Part Class: Extended Part; Datasheet: https://atta.szlcsc.com/upload/public/pdf/source/20160709/1468031880937.pdf; Supplier: LCSC; Convert to PCB: yes
IIC1 IIC2 SWD USART1 = AFC10-S04QCA-00: Manufacturer: JS(钜硕电子); Add into BOM: yes; Pins Structure: 1x4P; Pitch: 1mm; Gender: 公; Number of PINs Per Row: 4; Reference Series: SH; Current Rating (Max): 500mA; Description: 插针结构:1x4P;间距:1mm;公母:公;安装方式:卧贴;行距:-;排数:1;每排PIN数:4;参考系列:SH;额定电流:500mA;工作温度范围:-25℃~+85℃;; Symbol: AFC10-S04QCA-00; Device: AFC10-S04QCA-00; Supplier: LCSC; Supplier Part: C2764183; JLCPCB Part Class: Extended Part; LCSC Part Name: 1x4P 间距:1mm 卧贴 系列:SH; Supplier Footprint: SMD,P=1mm; Datasheet: https://atta.szlcsc.com/upload/public/pdf/source/20210330/C2764181_391AED87194E28CE940989A69A8EDCC4.pdf; Convert to PCB: yes; Mounting Style: 卧贴; Row Spacing: -; Number of Rows: 1; Operating Temperature Range: -25℃~+85℃
  IIC1: Name: IIC1; Manufacturer Part: IIC1
  IIC2: Name: IIC2; Manufacturer Part: IIC2
  SWD: Name: SWD; Manufacturer Part: SWD
  USART1: Name: USART1; Manufacturer Part: USART1
L1 = 0630 6.8uH: Symbol: SLO0630H2R2MTT; Convert to PCB: yes; Check: false; Device: 0630 6.8uH; Add into BOM: yes
L2 = CMH160808B3R3MT: Manufacturer: FH(风华); Add into BOM: yes; Value: 3.3uH; Tolerance: ±20%; Description: 电感值:3.3uH;精度:±20%;额定电流:-;直流电阻(DCR):-;; Symbol: CMH160808B3R3MT; Device: CMH160808B3R3MT; LCSC Part Name: 3.3uH ±20%; Supplier Part: C394951; Manufacturer Part: CMH160808B3R3MT; Supplier Footprint: 0603; JLCPCB Part Class: Extended Part; Datasheet: https://atta.szlcsc.com/upload/public/pdf/source/20190710/C394951_71BAFAF5AD49A9E7B15767971135924D.pdf; Supplier: LCSC; Convert to PCB: yes; Rated Current: -; DC Resistance (DCR): -
LED1 LED2 = XL-1608UBC-04: 发光颜色:蓝灯;透镜颜色:无色透明;主波长:460nm~469nm;峰值波长:475nm;色温:-;光通量(25时):-;测试电流:25mA;正向电压(VF):2.9V;发光强度:60mcd;功率:80mW;发光角度:120°;安装方式:正贴;工作温度:-30~+85;; Manufacturer: XINGLIGHT(成兴光); Add into BOM: yes; Emitted Color: 蓝灯; Lens Color: 无色透明; Peak Wavelength: 475nm; Forward Current: 25mA; Forward Voltage (VF): 2.9V; Luminous Intensity: 60mcd; Power Dissipation: 80mW; Viewing Angle: 120°; Mounting Sytle: 正贴; Name: XL-1608UBC-04; Symbol: XL-1608UBC-04; Device: XL-1608UBC-04; LCSC Part Name: 蓝灯 正贴; Supplier Part: C965807; Manufacturer Part: XL-1608UBC-04; Supplier Footprint: 0603; JLCPCB Part Class: Extended Part; Datasheet: https://atta.szlcsc.com/upload/public/pdf/source/20201230/C965807_0B1866580FA037C0283EE42D08A2BF0F.pdf; Supplier: LCSC; Convert to PCB: yes; Dominant Wavelength: 460nm~469nm; Color Temperature: -; Luminous Flux (@25℃): -; Operating Temperature: -30~+85
Q1-Q12 = NCE3080K: Manufacturer: NCE(无锡新洁能); Add into BOM: yes; Type: N沟道; Drain Source Voltage (Vdss): 30V; Continuous Drain Current (Id): 80A; Power Dissipation (Pd): 83W; Drain Source On Resistance (RDS(on)@Vgs,Id): 6.5mΩ@10V,30A; Gate Threshold Voltage (Vgs(th)@Id): 3V@250uA; Description: 类型:N沟道;漏源电压(Vdss):30V;连续漏极电流(Id):80A;功率(Pd):83W;导通电阻(RDS(on)@Vgs,Id):6.5mΩ@10V,30A;阈值电压(Vgs(th)@Id):3V@250uA;; Name: NCE3080K; Symbol: NCE3080K; Device: NCE3080K; LCSC Part Name: N沟道 30V 80A; Supplier Part: C108901; Manufacturer Part: NCE3080K; Supplier Footprint: TO-252-2(DPAK); JLCPCB Part Class: 扩展库; Datasheet: https://atta.szlcsc.com/upload/public/pdf/source/20170505/1493957853878.pdf; Supplier: LCSC; Convert to PCB: yes
R1 = 0603WAF2212T5E: 电阻类型:厚膜电阻;阻值:22.1kΩ;精度:±1%;功率:100mW;; Manufacturer: UNI-ROYAL(厚声); Add into BOM: yes; Temperature Coefficient: ±100ppm/℃; Tolerance: ±1%; Power(Watts): 100mW; Overload Voltage (Max): 75V; Name: 22.1kΩ; Symbol: 0603WAF2212T5E; Device: 0603WAF2212T5E; LCSC Part Name: 22.1kΩ ±1% 100mW; Supplier Part: C25961; Manufacturer Part: 0603WAF2212T5E; Supplier Footprint: 0603; JLCPCB Part Class: Extended Part; Datasheet: https://atta.szlcsc.com/upload/public/pdf/source/20200306/C422600_1E6D84923E4A46A82E41ADD87F860B5C.pdf; Supplier: LCSC; Convert to PCB: yes; Value: 22.1kΩ; Operating Temperature Range: -55℃~+155℃; Type: 厚膜电阻
R2 = 0603WAF1003T5E: Manufacturer: UNI-ROYAL(厚声); Add into BOM: yes; Tolerance: ±1%; Power(Watts): 100mW; Temperature Coefficient: ±100ppm/℃; Overload Voltage (Max): 75V; Description: 电阻类型:厚膜电阻;阻值:100kΩ;精度:±1%;功率:100mW;温度系数:±100ppm/℃;最大工作电压:75V;工作温度范围:-55℃~+155℃;; Name: 100kΩ; Symbol: 0603WAF1003T5E; Device: 0603WAF1003T5E; LCSC Part Name: 100kΩ ±1% 100mW; Supplier Part: C25803; Manufacturer Part: 0603WAF1003T5E; Supplier Footprint: 0603; JLCPCB Part Class: Basic Part; Datasheet: https://atta.szlcsc.com/upload/public/pdf/source/20200306/C422600_1E6D84923E4A46A82E41ADD87F860B5C.pdf; Supplier: LCSC; Convert to PCB: yes; Type: 厚膜电阻; Value: 100kΩ; Operating Temperature Range: -55℃~+155℃
R3 = 0603WAF2002T5E: Manufacturer: UNI-ROYAL(厚声); Add into BOM: yes; Tolerance: ±1%; Power(Watts): 100mW; Temperature Coefficient: ±100ppm/℃; Overload Voltage (Max): 75V; Description: 电阻类型:厚膜电阻;阻值:20kΩ;精度:±1%;功率:100mW;温度系数:±100ppm/℃;最大工作电压:75V;工作温度范围:-55℃~+155℃;; Name: 20kΩ; Symbol: 0603WAF2002T5E; Device: 0603WAF2002T5E; LCSC Part Name: 20kΩ ±1% 100mW; Supplier Part: C4184; Manufacturer Part: 0603WAF2002T5E; Supplier Footprint: 0603; JLCPCB Part Class: Basic Part; Datasheet: https://atta.szlcsc.com/upload/public/pdf/source/20200306/C422600_1E6D84923E4A46A82E41ADD87F860B5C.pdf; Supplier: LCSC; Convert to PCB: yes; Type: 厚膜电阻; Value: 20kΩ; Operating Temperature Range: -55℃~+155℃
R4 = 0603WAF1002T5E: 电阻类型:厚膜电阻;阻值:10kΩ;精度:±1%;功率:100mW;温度系数:±100ppm/℃;最大工作电压:75V;工作温度范围:-55℃~+155℃;; Manufacturer: UNI-ROYAL(厚声); Add into BOM: yes; Tolerance: ±1%; Power(Watts): 100mW; Overload Voltage (Max): 75V; Name: 10kΩ; Symbol: 0603waf1002t5e; Device: 0603WAF1002T5E; LCSC Part Name: 10kΩ ±1% 100mW; Supplier Part: C25804; Manufacturer Part: 0603WAF1002T5E; Supplier Footprint: 0603; JLCPCB Part Class: Basic Part; Datasheet: https://atta.szlcsc.com/upload/public/pdf/source/20200306/C422600_1E6D84923E4A46A82E41ADD87F860B5C.pdf; Supplier: LCSC; Convert to PCB: yes; Type: 厚膜电阻; Value: 10kΩ; Temperature Coefficient: ±100ppm/℃; Operating Temperature Range: -55℃~+155℃
R6 R9 R10 R27 R28 R30 R31 R47 R48 = 0603WAF1002T5E: Manufacturer: UNI-ROYAL(厚声); Add into BOM: yes; Tolerance: ±1%; Power(Watts): 100mW; Temperature Coefficient: ±100ppm/℃; Overload Voltage (Max): 75V; Description: 电阻类型:厚膜电阻;阻值:10kΩ;精度:±1%;功率:100mW;; Symbol: 0603WAF1002T5E; Device: 0603WAF1002T5E; LCSC Part Name: 厚膜电阻 10kΩ ±1% 100mW; Supplier Part: C25804; Manufacturer Part: 0603WAF1002T5E; Supplier Footprint: 0603; JLCPCB Part Class: Basic Part; Datasheet: https://atta.szlcsc.com/upload/public/pdf/source/20200306/C422600_1E6D84923E4A46A82E41ADD87F860B5C.pdf; Supplier: LCSC; Convert to PCB: yes; Type: 厚膜电阻; Operating Temperature Range: -55℃~+155℃
  R6 R9 R10 R47 R48: Name: 10kΩ; Value: 10kΩ
  R27 R28 R30 R31: Name: 2kΩ; Value: 2kΩ
R8 = 0603WAF1200T5E: Manufacturer: UNI-ROYAL(厚声); Add into BOM: yes; Tolerance: ±1%; Power(Watts): 100mW; Temperature Coefficient: ±100ppm/℃; Overload Voltage (Max): 75V; Description: 电阻类型:厚膜电阻;阻值:120Ω;精度:±1%;功率:100mW;; Name: 120Ω; Symbol: 0603WAF1200T5E; Device: 0603WAF1200T5E; LCSC Part Name: 120Ω ±1% 100mW; Supplier Part: C22787; Manufacturer Part: 0603WAF1200T5E; Supplier Footprint: 0603; JLCPCB Part Class: Basic Part; Datasheet: https://atta.szlcsc.com/upload/public/pdf/source/20200306/C422600_1E6D84923E4A46A82E41ADD87F860B5C.pdf; Supplier: LCSC; Convert to PCB: yes; Type: 厚膜电阻; Value: 120Ω; Operating Temperature Range: -55℃~+155℃
R11 R25 R49 R50 = 0603WAF5101T5E: 电阻类型:厚膜电阻;阻值:5.1kΩ;精度:±1%;功率:100mW;温度系数:±100ppm/℃;; Manufacturer: UNI-ROYAL(厚声); Add into BOM: yes; Tolerance: ±1%; Power(Watts): 100mW; Overload Voltage (Max): 75V; Symbol: 0603WAF5101T5E; Device: 0603WAF5101T5E; Supplier: LCSC; Manufacturer Part: 0603WAF5101T5E; Supplier Part: C23186; JLCPCB Part Class: Basic Part; LCSC Part Name: 厚膜电阻 5.1kΩ ±1% 100mW; Supplier Footprint: 0603; Datasheet: https://atta.szlcsc.com/upload/public/pdf/source/20200306/C422600_1E6D84923E4A46A82E41ADD87F860B5C.pdf; Convert to PCB: yes; Type: 厚膜电阻; Temperature Coefficient: ±100ppm/℃; Operating Temperature Range: -55℃~+155℃
  R11 R25: Name: 5.1kΩ; Value: 5.1kΩ
  R49: Name: 91kΩ; Value: 91kΩ
  R50: Name: 10kΩ; Value: 10kΩ
R12-R14 R42-R44 = 0603WAF1000T5E: 电阻类型:厚膜电阻;阻值:100Ω;精度:±1%;功率:100mW;; Manufacturer: UNI-ROYAL(厚声); Add into BOM: yes; Tolerance: ±1%; Power(Watts): 100mW; Temperature Coefficient: ±200ppm/℃; Overload Voltage (Max): 75V; Name: 100Ω; Symbol: 0603WAF1000T5E; Device: 0603WAF1000T5E; LCSC Part Name: 100Ω ±1% 100mW; Supplier Part: C22775; Manufacturer Part: 0603WAF1000T5E; Supplier Footprint: 0603; JLCPCB Part Class: Basic Part; Datasheet: https://atta.szlcsc.com/upload/public/pdf/source/20200306/C422600_1E6D84923E4A46A82E41ADD87F860B5C.pdf; Supplier: LCSC; Convert to PCB: yes; Type: 厚膜电阻; Operating Temperature Range: -55℃~+155℃; Value: 100Ω
R15-R20 R32-R37 = 0805W8F100JT5E: Manufacturer: UNI-ROYAL(厚声); Add into BOM: yes; Tolerance: ±1%; Power(Watts): 125mW; Temperature Coefficient: ±200ppm/℃; Overload Voltage (Max): 150V; Description: 电阻类型:厚膜电阻;阻值:10Ω;精度:±1%;功率:125mW;; Name: 10Ω; Symbol: 0805W8F100JT5E; Device: 0805W8F100JT5E; LCSC Part Name: 10Ω ±1% 125mW; Supplier Part: C17415; Manufacturer Part: 0805W8F100JT5E; Supplier Footprint: 0805; JLCPCB Part Class: 基础库; Datasheet: https://atta.szlcsc.com/upload/public/pdf/source/20200306/C422600_1E6D84923E4A46A82E41ADD87F860B5C.pdf; Supplier: LCSC; Convert to PCB: yes; Type: 厚膜电阻; Value: 10Ω; Operating Temperature Range: -55℃~+155℃
R21 R22 R40 R41 = RLP25FEER005: Manufacturer: 大毅科技; Add into BOM: yes; Tolerance: ±1%; Power(Watts): 2W; Temperature Coefficient: ±50ppm/℃; Description: 阻值:5mΩ;精度:±1%;功率:2W;; Name: 5mΩ; Symbol: RLP25FEER005; Device: RLP25FEER005; LCSC Part Name: 5mΩ ±1% 2W; Supplier Part: C316228; Manufacturer Part: RLP25FEER005; Supplier Footprint: 2512; JLCPCB Part Class: 扩展库; Datasheet: https://atta.szlcsc.com/upload/public/pdf/source/20181023/C316228_66D2B2FCD28B27A9DF31AD578F0629CF.pdf; Supplier: LCSC; Convert to PCB: yes; Value: 5mΩ
R23 R24 R38 R39 = 0603WAF1001T5E: Manufacturer: UNI-ROYAL(厚声); Add into BOM: yes; Tolerance: ±1%; Power(Watts): 100mW; Temperature Coefficient: ±100ppm/℃; Overload Voltage (Max): 75V; Description: 电阻类型:厚膜电阻;阻值:1kΩ;精度:±1%;功率:100mW;温度系数:±100ppm/℃;; Name: 1kΩ; Symbol: 0603WAF1001T5E; Device: 0603WAF1001T5E; Supplier: LCSC; Manufacturer Part: 0603WAF1001T5E; Supplier Part: C21190; Value: 1kΩ; JLCPCB Part Class: 基础库; LCSC Part Name: 厚膜电阻 1kΩ ±1% 100mW; Supplier Footprint: 0603; Datasheet: https://atta.szlcsc.com/upload/public/pdf/source/20200306/C422600_1E6D84923E4A46A82E41ADD87F860B5C.pdf; Convert to PCB: yes; Type: 厚膜电阻; Operating Temperature Range: -55℃~+155℃
U1 U2 V1 V2 W1 W2 = PAD: Add into BOM: yes; PCB DECAL: PCB-5; Name: PAD; Symbol: PAD; Device: PAD; Convert to PCB: yes; OldName: PAD
U3 = MT2492: Manufacturer: 西安航天民芯; Add into BOM: yes; Function: 降压型; Description: 功能类型:降压型;同步整流:-;输出通道数:-;拓扑结构:-;输入电压:-;输出电流(最大值):-;开关频率:-;; Symbol: MT2492; Device: MT2492; LCSC Part Name: 降压型; Supplier Part: C89358; Manufacturer Part: MT2492; Supplier Footprint: SOT-23-6; JLCPCB Part Class: Extended Part; Datasheet: https://atta.szlcsc.com/upload/public/pdf/source/20221209/5C81DA9662873D3A116170FFBF63E49D.pdf; Supplier: LCSC; Convert to PCB: yes; Synchronous Rectification: -; Number of Outputs: -; Topology: -; Input Voltage: -; Output Current (Max): -; Switching Frequency: -
U4 = SIT65HVD230DR: Manufacturer: SIT(芯力特); Add into BOM: yes; Description: 类型:-;; Name: SIT65HVD230DR; Symbol: SIT65HVD230DR; Device: SIT65HVD230DR; LCSC Part Name: SIT65HVD230DR; Supplier Part: C496619; Manufacturer Part: SIT65HVD230DR; Supplier Footprint: SOP-8; JLCPCB Part Class: 扩展库; Datasheet: https://atta.szlcsc.com/upload/public/pdf/source/20200313/C496619_AFEDC6182C941FC5FA6F8E58312D272B.pdf; Supplier: LCSC; Convert to PCB: yes; Type: -
U5 = AT32F415CBT7_C528427: Manufacturer: ARTERY(雅特力); Add into BOM: yes; CPU Core: ARM Cortex-M4; Program Storage Size: 128KB; Program Memory Type: FLASH; RAM Size: 32KB; Description: CPU内核:ARM Cortex-M4;CPU最大主频:-;程序存储容量:128KB;程序存储器类型:FLASH;RAM总容量:32KB;GPIO端口数量:-;; Name: AT32F415CBT7; Symbol: AT32F415CBT7; Device: AT32F415CBT7_C528427; LCSC Part Name: ARM Cortex-M4; Supplier Part: C528427; Manufacturer Part: AT32F415CBT7; Supplier Footprint: LQFP-48(7x7); JLCPCB Part Class: Extended Part; Datasheet: https://atta.szlcsc.com/upload/public/pdf/source/20200507/C528425_955931935851DA1D79A558202FE2F03A.pdf; Supplier: LCSC; Convert to PCB: yes; CPU Maximum Speed: -; Operating Voltage Range: -; EEPROM: -; GPIO Ports Number: -; ADC (Bit): -; DAC (Bit): -; PWM (Bit): -; Universal Serial Bus: -; Internal Comparator: -; communication protocol: -; Watchdog: -; Real-Time Clock: -; Infrared Data Association: -; Low-Voltage Detect: -; CCP Capture/Compare: -; Secure Digital Input and Output: -; Direct Memory Access: -; Internal Oscillator: -
U6 = AT24C02C-SSHM-T: Manufacturer: MICROCHIP(美国微芯); Add into BOM: yes; Memory Format: EEPROM; Memory Size: 2Kb (256 x 8); Memory Interface: I2C; Voltage - Supply: 1.7V ~ 5.5V; Description: 存储器容量:2Kb (256 x 8);存储器接口类型:I2C;工作电压:1.7V ~ 5.5V;; Symbol: AT24C02C-SSHM-T; Device: AT24C02C-SSHM-T; LCSC Part Name: AT24C02C-SSHM-T; Supplier Part: C6203; Manufacturer Part: AT24C02C-SSHM-T; Supplier Footprint: SOIC-8_150mil; JLCPCB Part Class: Extended Part; Datasheet: https://atta.szlcsc.com/upload/public/pdf/source/20151231/1457707659939.pdf; Supplier: LCSC; Convert to PCB: yes
U7 U11 = EG2133_C190343: Manufacturer: EG(屹晶微); Add into BOM: yes; Description: EG2133是一款高性价比的三相半桥驱动芯片，配合六颗Nmos可以组成三相直流无刷电机驱动器。; Name: EG2133; Symbol: EG2133; Device: EG2133_C190343; LCSC Part Name: EG2133; Supplier Part: C190343; Manufacturer Part: EG2133; Supplier Footprint: TSSOP-20; JLCPCB Part Class: 扩展库; Datasheet: https://atta.szlcsc.com/upload/public/pdf/source/20220627/F8A393EEBF3325F22DCB485BC683267F.pdf; Supplier: LCSC; Convert to PCB: yes
U8 U9 U12 U13 = TP181A1-CR: Manufacturer: 3PEAK; Add into BOM: yes; Name: TP181A1-CR; Symbol: TP181A1-CR; Device: TP181A1-CR; Supplier: LCSC; Supplier Part: C2902349; Manufacturer Part: TP181A1-CR; JLCPCB Part Class: 扩展库; LCSC Part Name: TP181A1-CR; Supplier Footprint: SC70-6; Datasheet: https://atta.szlcsc.com/upload/public/pdf/source/20230301/6D62DABF8769A8088870FFE026FF2C6D.pdf; Convert to PCB: yes
U15 = XT30: Add into BOM: yes; Name: XT30; Symbol: XT30; Device: XT30; Convert to PCB: yes; Origin Footprint: XT-30
U16 = 0.91OLED-4P-IIC模块: Pin Type: IN; Add into BOM: yes; Symbol: 0.91OLED-4P-IIC模块; Device: 0.91OLED-4P-IIC模块; Convert to PCB: yes
U17 = MPU-6050: Manufacturer: TDK InvenSense(应美盛); Symbol: MPU-6050_C24112; Add into BOM: yes; Description: 三轴加速度计和三轴陀螺仪，工作电压：2.375V~3.46V; Name: MPU-6050; Device: MPU-6050; Supplier: LCSC; Manufacturer Part: MPU-6050; Supplier Part: C24112; JLCPCB Part Class: 扩展库; LCSC Part Name: MPU-6050; Supplier Footprint: QFN-24(4x4); Datasheet: https://atta.szlcsc.com/upload/public/pdf/source/20140425/1457707046159.pdf; Convert to PCB: yes
X2 = CSTCE8M00G52-R0: Manufacturer: muRata(村田); Add into BOM: yes; Frequency Tolerance: ±0.5%; Built-in Load Capacitance: 10pF; Resonant Impedance: 40Ω; Description: 频率:8MHz;频率容差:±0.5%;内置负载电容:10pF;谐振阻抗:40Ω;; Name: 8MHz; Symbol: CSTCE8M00G52-R0; Device: CSTCE8M00G52-R0; Supplier: LCSC; Manufacturer Part: CSTCE8M00G52-R0; Value: 8MHz; Supplier Part: C22549; JLCPCB Part Class: 扩展库; LCSC Part Name: 8MHz ±0.5% 内置负载电容:10pF; Supplier Footprint: SMD3213-3P; Datasheet: https://atta.szlcsc.com/upload/public/pdf/source/20160120/1457707754326.pdf; Convert to PCB: yes; Operating Temperature: -20℃~+80℃